# Altium schematic sheet MAIN.SchDoc
size A4
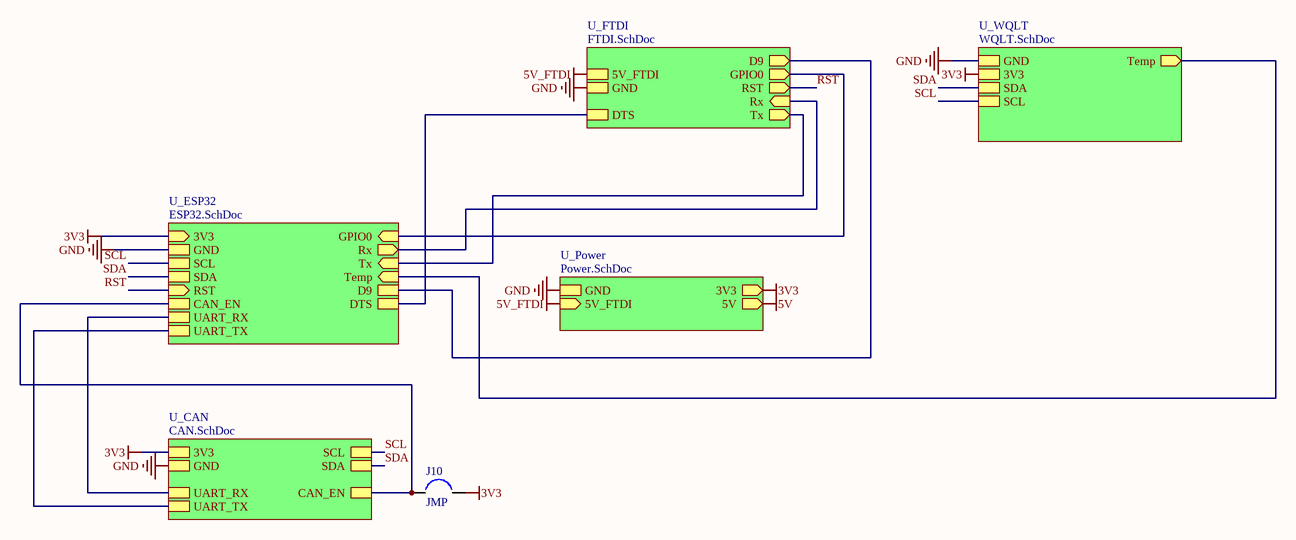
[diagram p0: MAIN.SchDoc]

## Parts
J10  JMP  [Jumper]

## Sub-sheets
U_CAN = CAN.SchDoc: SDA, SCL, 3V3, CAN_EN, GND, UART_RX, UART_TX
U_ESP32 = ESP32.SchDoc: 3V3 (in), GND, SCL, SDA, GPIO0 (in), Temp (in), Tx (in), Rx (out), D9, RST (in), DTS, CAN_EN, UART_RX, UART_TX
U_FTDI = FTDI.SchDoc: D9 (out), RST (out), GND, Rx (in), Tx (out), 5V_FTDI, GPIO0 (out), DTS
U_Power = Power.SchDoc: 3V3 (out), GND, 5V (out), 5V_FTDI (in)
U_WQLT = WQLT.SchDoc: GND, Temp (out), 3V3, SDA, SCL

## Nets
3V3: J10.2 ; sheet U_ESP32/3V3, sheet U_WQLT/3V3, sheet U_Power/3V3, sheet U_CAN/3V3
5V: sheet U_Power/5V
5V_FTDI: sheet U_FTDI/5V_FTDI, sheet U_Power/5V_FTDI
GND: sheet U_ESP32/GND, sheet U_FTDI/GND, sheet U_WQLT/GND, sheet U_Power/GND, sheet U_CAN/GND
RST: sheet U_ESP32/RST, sheet U_FTDI/RST
SCL: sheet U_ESP32/SCL, sheet U_WQLT/SCL, sheet U_CAN/SCL
SDA: sheet U_ESP32/SDA, sheet U_WQLT/SDA, sheet U_CAN/SDA
NetJ10_1: J10.1 ; sheet U_ESP32/CAN_EN, sheet U_CAN/CAN_EN
(unnamed): sheet U_ESP32/GPIO0, sheet U_FTDI/GPIO0
(unnamed): sheet U_ESP32/Temp, sheet U_WQLT/Temp
(unnamed): sheet U_ESP32/Tx, sheet U_FTDI/Tx
(unnamed): sheet U_ESP32/Rx, sheet U_FTDI/Rx
(unnamed): sheet U_ESP32/D9, sheet U_FTDI/D9
(unnamed): sheet U_ESP32/DTS, sheet U_FTDI/DTS
(unnamed): sheet U_ESP32/UART_RX, sheet U_CAN/UART_RX
(unnamed): sheet U_ESP32/UART_TX, sheet U_CAN/UART_TX